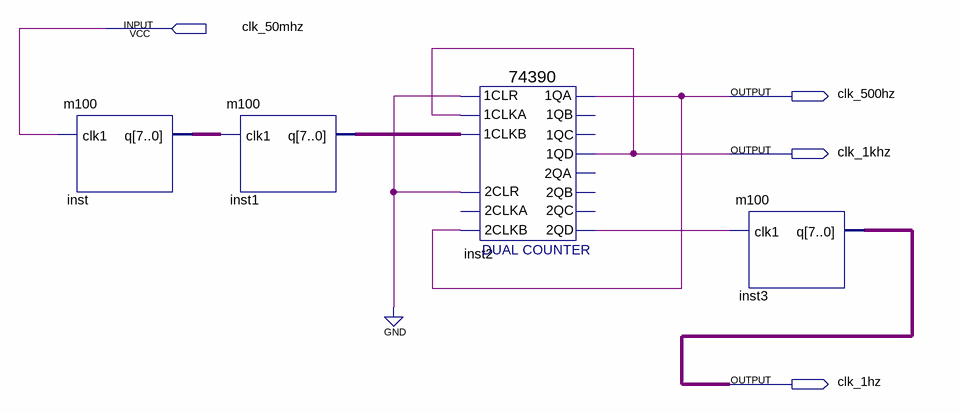
[diagram p0: schematic sheet]
// Quartus schematic fre_div.bdf as structural Verilog: 4 symbols, 4 pins
module fre_div (
  input  clk_50mhz,
  output clk_500hz,
  output clk_1khz,
  output clk_1hz
);

  wire inst2_2qd;
  wire [7:0] inst1_q, inst3_q, inst_q;

  m100 inst (.clk1(clk_50mhz), .q(inst_q));
  m100 inst1 (.clk1(inst_q), .q(inst1_q));
  \74390  inst2 (
    .\2CLR (1'b0), .\2CLKB (clk_500hz), .\1CLR (1'b0), .\1CLKA (clk_1khz), .\1CLKB (inst1_q),
    .\1QA (clk_500hz), .\1QD (clk_1khz), .\2QD (inst2_2qd));  // open: 2CLKA, 1QB, 1QC, 2QA, 2QB, 2QC
  m100 inst3 (.clk1(inst2_2qd), .q(inst3_q));
endmodule
